# Altium schematic sheet Halfbridges.SchDoc
size 292 x 254 mm; CompanyName: Technische Hochschule Nürnberg Georg Simon Ohm; Organization: UltraZohm; Address1: Kesslerplatz 12; Address2: 90489 Nürnberg; Address3: GERMANY; SheetNumber: 5; SheetTotal: 8; Website: www.ultrazohm.com
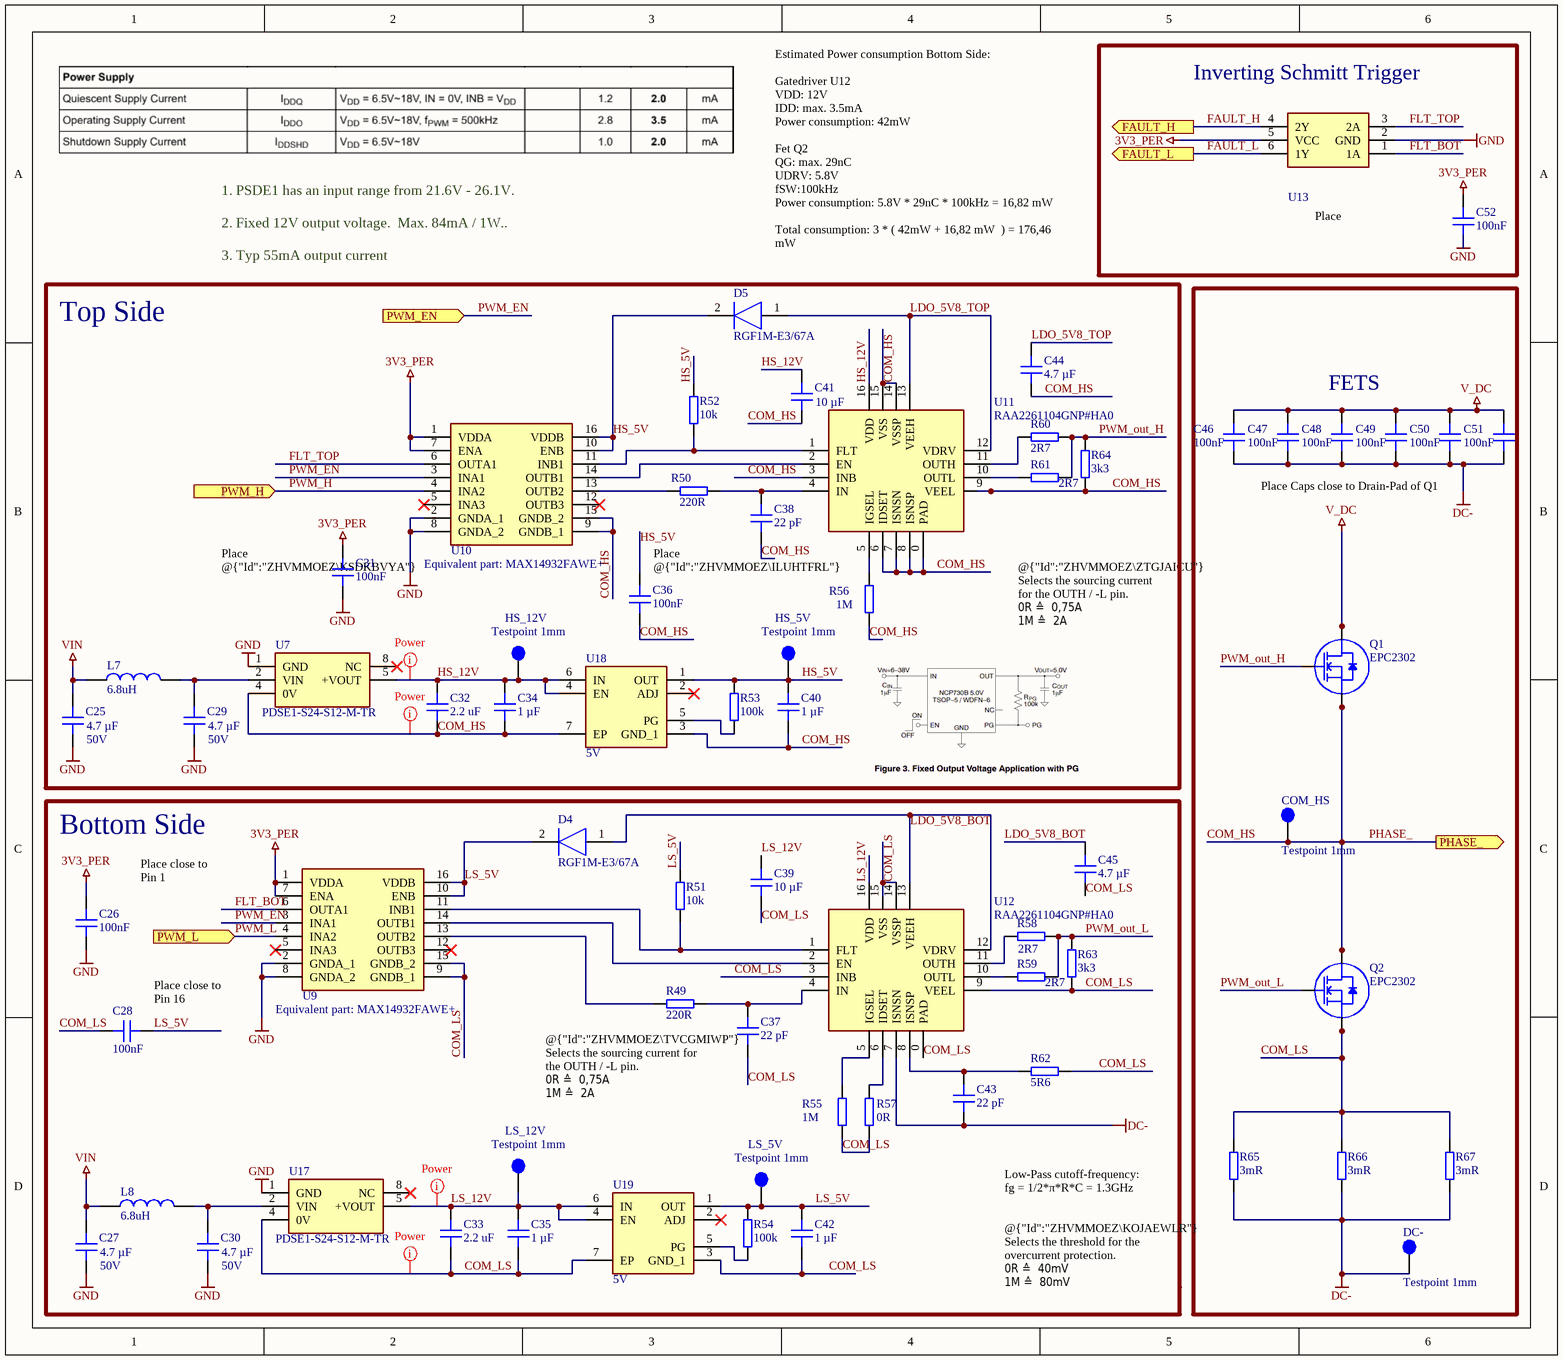
[diagram p0: Halfbridges.SchDoc]

## Parts
C25  4.7 µF  [C_0603]
C26  100nF  [C_0603]
C27  4.7 µF  [C_0603]
C28  100nF  [C_0603]
C29  4.7 µF  [C_0603]
C30  4.7 µF  [C_0603]
C31  100nF  [C_0603]
C32  2.2 uF  [C_0603]
C33  2.2 uF  [C_0603]
C34  1 µF  [C_0603]
C35  1 µF  [C_0603]
C36  100nF  [C_0603]
C37  22 pF  [C_0603]
C38  22 pF  [C_0603]
C39  10 µF  [C_0805]
C40  1 µF  [C_0603]
C41  10 µF  [C_0805]
C42  1 µF  [C_0603]
C43  22 pF  [C_0603]
C44  4.7 µF  [C_0603]
C45  4.7 µF  [C_0603]
C46  100nF  [C_0603]
C47  100nF  [C_0603]
C48  100nF  [C_0603]
C49  100nF  [C_0603]
C50  100nF  [C_0603]
C51  100nF  [C_0603]
C52  100nF  [C_0603]
COM_HS  Testpoint 1mm  [TP_1mm]  (no BOM)
D4  RGF1M-E3/67A  [FP-GF1M-E3-67A-MFG]
D5  RGF1M-E3/67A  [FP-GF1M-E3-67A-MFG]
DC-  Testpoint 1mm  [TP_1mm]  (no BOM)
HS_5V  Testpoint 1mm  [TP_1mm]  (no BOM)
HS_12V  Testpoint 1mm  [TP_1mm]  (no BOM)
L7  6.8uH  [INDC1608X95N]
L8  6.8uH  [INDC1608X95N]
LS_5V  Testpoint 1mm  [TP_1mm]  (no BOM)
LS_12V  Testpoint 1mm  [TP_1mm]  (no BOM)
Q1  EPC2302  [D0606F_100V]
Q2  EPC2302  [D0606F_100V]
R49  220R  [RES 0603_1608]
R50  220R  [RES 0603_1608]
R51  10k  [RES 0603_1608]
R52  10k  [RES 0603_1608]
R53  100k  [RES 0603_1608]
R54  100k  [RES 0603_1608]
R55  1M  [RES 1206_3216]
R56  1M  [RES 1206_3216]
R57  0R  [RES 0603_1608]
R58  2R7  [RES 0603_1608]
R59  2R7  [RES 0603_1608]
R60  2R7  [RES 0603_1608]
R61  2R7  [RES 0603_1608]
R62  5R6  [RES 0603_1608]
R63  3k3  [RES 0603_1608]
R64  3k3  [RES 0603_1608]
R65  3mR  [FP-KRL2012-MFG]
R66  3mR  [FP-KRL2012-MFG]
R67  3mR  [FP-KRL2012-MFG]
U7  PDSE1-S24-S12-M-TR  [PDSE1S24S12MTR]
U9  (no value)  [SOIC127P600X175-16N]
U10  (no value)  [SOIC127P600X175-16N]
U11  RAA2261104GNP#HA0  [RAA2261104GNP#HA0]
U12  RAA2261104GNP#HA0  [RAA2261104GNP#HA0]
U13  SN74LVC2G14DBVR  [SOT95P280X145-6N]  (value not drawn)
U17  PDSE1-S24-S12-M-TR  [PDSE1S24S12MTR]
U18  5V  [SON65P200X200X80-7N]
U19  5V  [SON65P200X200X80-7N]

## Blocks framed on the sheet
Inverting Schmitt Trigger: C52 U13
Top Side: C25 C29 C31 C32 C34 C36 C38 C40 C41 C44 D5 HS_5V HS_12V L7 R50 R52 R53 R56 R60 R61 R64 U7 U10 U11 U18
FETS: C46-C51 COM_HS DC- Q1 Q2 R65-R67

## Ports
FAULT_H (out), FAULT_L (out), PHASE_ (out), PWM_EN (in), PWM_H (in), PWM_L (in)

## Nets
3V3_PER: C26.2 C31.2 C52.2 U9.1(VDDA) U9.7(ENA) U10.1(VDDA) U10.7(ENA) U13.5(VCC)
DC-: C43.1 C46.1 C47.1 C48.1 C49.1 C50.1 C51.1 DC-.1 R65.1 R66.1 R67.1 U12.7(ISNSN)
GND: C25.2 C26.1 C27.2 C29.2 C30.2 C31.1 C52.1 U7.1(GND) U9.2(GNDA_1) U9.8(GNDA_2) U10.2(GNDA_1) U10.8(GNDA_2) U13.2(GND) U17.1(GND)
V_DC: C46.2 C47.2 C48.2 C49.2 C50.2 C51.2 Q1.3(D) Q1.5(D) Q1.7(D)
VIN: C25.1 C27.1 L7.1 L8.1
COM_HS: C32.1 C34.1 C36.1 C38.1 C40.1 C41.2 C44.2 COM_HS.1 Q1.2(S) Q1.4(S) Q1.6(S) Q2.3(D) Q2.5(D) Q2.7(D) R56.1 R64.1 U7.4(0V) U10.9(GNDB_1) U10.15(GNDB_2) U11.0(PAD) U11.3(INB) U11.6(IDSET) U11.7(ISNSN) U11.8(ISNSP) U11.9(VEEL) U11.14(VSSP) U11.15(VSS) U18.3(GND_1) U18.7(EP) ; port PHASE_  [also labelled PHASE_]
COM_LS: C28.2 C33.1 C35.1 C37.1 C39.2 C42.1 C45.1 Q2.2(S) Q2.4(S) Q2.6(S) R55.1 R57.1 R62.2 R63.1 R65.2 R66.2 R67.2 U9.9(GNDB_1) U9.15(GNDB_2) U12.0(PAD) U12.3(INB) U12.9(VEEL) U12.14(VSSP) U12.15(VSS) U17.4(0V) U19.3(GND_1) U19.7(EP)
FAULT_H: U13.4(2Y) ; port FAULT_H
FAULT_L: U13.6(1Y) ; port FAULT_L
FLT_BOT: U9.6(OUTA1) U13.1(1A)
FLT_TOP: U10.6(OUTA1) U13.3(2A)
HS_5V: C36.2 C40.2 D5.2(K) HS_5V.1 R52.2 R53.2 U10.10(ENB) U10.16(VDDB) U18.1(OUT)
HS_12V: C32.2 C34.2 C41.1 HS_12V.1 U7.5(+VOUT) U11.16(VDD) U18.4(EN) U18.6(IN)
LDO_5V8_BOT: C45.2 D4.1(A) U12.12(VDRV) U12.13(VEEH)
LDO_5V8_TOP: C44.1 D5.1(A) U11.12(VDRV) U11.13(VEEH)
LS_5V: C28.1 C42.2 D4.2(K) LS_5V.1 R51.2 R54.2 U9.10(ENB) U9.16(VDDB) U19.1(OUT)
LS_12V: C33.2 C35.2 C39.1 LS_12V.1 U12.16(VDD) U17.5(+VOUT) U19.4(EN) U19.6(IN)
PWM_EN: U9.3(INA1) U10.3(INA1) ; port PWM_EN
PWM_H: U10.4(INA2) ; port PWM_H
PWM_L: U9.4(INA2) ; port PWM_L
PWM_out_H: Q1.1(G) R60.2 R61.2 R64.2
PWM_out_L: Q2.1(G) R58.2 R59.2 R63.2
NetC29_1: C29.1 L7.2 U7.2(VIN)
NetC30_1: C30.1 L8.2 U17.2(VIN)
NetC37_2: C37.2 R49.2 U12.4(IN)
NetC38_2: C38.2 R50.2 U11.4(IN)
NetC43_2: C43.2 R62.1 U12.8(ISNSP)
NetR49_1: R49.1 U9.13(OUTB2)
NetR50_1: R50.1 U10.13(OUTB2)
NetR51_1: R51.1 U9.11(INB1) U12.1(FLT)
NetR52_1: R52.1 U10.11(INB1) U11.1(FLT)
NetR53_1: R53.1 U18.5(PG)
NetR54_1: R54.1 U19.5(PG)
NetR55_2: R55.2 U12.5(IGSEL)
NetR56_2: R56.2 U11.5(IGSEL)
NetR57_2: R57.2 U12.6(IDSET)
NetR58_1: R58.1 U12.11(OUTH)
NetR59_1: R59.1 U12.10(OUTL)
NetR60_1: R60.1 U11.11(OUTH)
NetR61_1: R61.1 U11.10(OUTL)
NetU9_14: U9.14(OUTB1) U12.2(EN)
NetU10_14: U10.14(OUTB1) U11.2(EN)

Not connected (* = marked no-connect by the designer): U7 8(NC)*; U9 5(INA3)* 12(OUTB3)*; U10 5(INA3)* 12(OUTB3)*; U17 8(NC)*; U18 2(ADJ)*; U19 2(ADJ)*

## Layout directives
net class Power: COM_HS, COM_LS, HS_12V, LS_12V

## Notes on the sheet
- (near C52) Place @{"Id":"ZHVMMOEZ\VVFJCAOA"} close to U13
- 1. PSDE1 has an input range from 21.6V - 26.1V.
  2. Fixed 12V output voltage.  Max. 84mA / 1W..
  3. Typ 55mA output current
- Estimated Power consumption Bottom Side:
  Gatedriver U12
  VDD: 12V
  IDD: max. 3.5mA
  Power consumption: 42mW
  Fet Q2
  QG: max. 29nC
  UDRV: 5.8V
  fSW:100kHz
  Power consumption: 5.8V * 29nC * 100kHz = 16,82 mW
  Total consumption: 3 * ( 42mW + 16,82 mW  ) = 176,46 mW
- Place Caps close to Drain-Pad of Q1
- (near C31) Place @{"Id":"ZHVMMOEZ\KSDKBVYA"} close to Pin 1
- Equivalent part: MAX14932FAWE+
- Place @{"Id":"ZHVMMOEZ\ILUHTFRL"} close to Pin 16
- @{"Id":"ZHVMMOEZ\ZTGJAICU"} Selects the sourcing current for the OUTH / -L pin.
  0R ≙  0,75A
  1M ≙  2A
- (near C25) 50V
- (near C29) 50V
- Bottom Side
- Place close to Pin 1
- (near C28) Place close to Pin 16
- (near U9) Equivalent part: MAX14932FAWE+
- @{"Id":"ZHVMMOEZ\TVCGMIWP"} Selects the sourcing current for the OUTH / -L pin.
  0R ≙  0,75A
  1M ≙  2A
- Low-Pass cutoff-frequency:
  fg = 1/2*π*R*C = 1.3GHz
- (near C27) 50V
- (near C30) 50V
- @{"Id":"ZHVMMOEZ\KOJAEWLR"} Selects the threshold for the overcurrent protection.
  0R ≙  40mV
  1M ≙  80mV
- Title
- Revision:
- Design Engineer:
- Date:
- Project:
- Sheet
- of

## Library data of the parts
C25 C27 C29 C30 C44 C45 = GRM188R6YA475KE15D: Capacitor 0603, 35 VDC, 4.7 µF, X5R; Manufacturer: muRata; Tolerance: 10 %; Voltage Rating: 35 VDC; Created from: MGremer; Manufacturer Part Number: GRM188R6YA475KE15D; PartID: 11; Created On: 12/20/2020 1:54:13 PM; ComponentLink1Description: Datasheet; ComponentLink1URL: https://www.mouser.de/datasheet/2/281/murata_03052018_GRM_Series_1-1310166.pdf; Component Type: Capacitor 0603; Device Package: 0603; Last Updated: 7/5/2023 3:51:21 PM; Mounting Type: SMD; Operating Temperature: -55 - 85°C; Series: GRM; Supplier 1: Mouser; Supplier Part Number 1: 81-GRM188R6YA475KE5D; Type: Capacitor; Value: 4.7 µF; Live Cycle Status: 1; Stock number: Labor SMD Container; LCSC Part Number: C162274
C26 C28 C31 C36 C46-C52 = CGA3E3X8R1H104KT0Y0N: 50V 100nF X8R ±10% 0603; Manufacturer: TDK; Voltage Rating: 50 VDC; Created from: KIlhan; Manufacturer Part Number: CGA3E3X8R1H104KT0Y0N; PartID: 131; Created On: 7/5/2023 7:32:58 PM; ComponentLink1Description: Datasheet; ComponentLink1URL: https://datasheet.lcsc.com/lcsc/2304140030_TDK-CGA3E3X8R1H104KT0Y0N_C342825.pdf; Component Type: Capacitor 0603; Device Package: 0603; Last Updated: 7/5/2023 7:32:58 PM; Mounting Type: SMD; Operating Temperature: -55 - 125°C; Series: CGA; Supplier 1: LCSC; Supplier Part Number 1: C342825; Type: Capacitor; Tolerance: 10 %; Value: 100nF; Live Cycle Status: 1; Stock number: not stored; LCSC Part Number: C342825
C32 C33 = FS18B225K250PBG: 25V 2.2uF X5R 0603 Multilayer Ceramic Capacitors MLCC; Manufacturer: PSA(Prosperity Dielectrics); Tolerance: 10 %; Voltage Rating: 25 VDC; Created from: KIlhan; Manufacturer Part Number: FS18B225K250PBG; PartID: 132; Created On: 7/5/2023 10:46:36 PM; ComponentLink1Description: Datasheet; ComponentLink1URL: https://jlcpcb.com/partdetail/3261675-FS18B225K250PBG/C2929194; Component Type: Capacitor 0603; Device Package: 0603; Last Updated: 7/5/2023 10:46:36 PM; Mounting Type: SMD; Operating Temperature: -55 - 125°C; Series: FS; Supplier 1: LCSC; Supplier Part Number 1: C2929194; Type: Capacitor; Value: 2.2 uF; Live Cycle Status: 1; LCSC Part Number: C2929194; Stock number: not stored
C34 C35 C40 C42 = UMK107AB7105KA-T: 50V 1uF X7R ±10% 0603 Multilayer Ceramic Capacitors MLCC - SMD/SMT ROHS; Manufacturer: Taiyo Yuden; Voltage Rating: 50 VDC; Created from: NDiringer; Manufacturer Part Number: UMK107AB7105KA-T; PartID: 98; Created On: 8/9/2022 9:35:02 AM; ComponentLink1Description: Datasheet; ComponentLink1URL: https://www.mouser.de/datasheet/2/396/mlcc02_e-1307760.pdf; Component Type: Capacitor 0603; Device Package: 0603; Last Updated: 9/21/2022 4:11:37 PM; Mounting Type: SMD; Operating Temperature: -55 - 125°C; Series: X7R; Supplier 1: LCSC; Supplier Part Number 1: C105174; Type: Capacitor; Tolerance: 10 %; Value: 1 µF; Live Cycle Status: 1; Stock number: not stored; LCSC Part Number: C105174; Supplier 2: Mouser; Supplier Part Number 2: 963-UMK107AB7105MA-T
C37 C38 C43 = AC0603FRNPO9BN220: 50V 22pF NP0 ±1% 0603 Multilayer Ceramic Capacitors MLCC - SMD/SMT ROHS; Manufacturer: YAGEO; Voltage Rating: 50 VDC; Created from: KIlhan; Manufacturer Part Number: AC0603FRNPO9BN220; PartID: 129; Created On: 7/5/2023 3:59:48 PM; ComponentLink1Description: Datasheet; ComponentLink1URL: https://www.mouser.de/datasheet/2/447/UPY_AC_NP0X7RX7S_6_3V_to_2KV_18-3003021.pdf; Component Type: Capacitor 0603; Device Package: 0603; Last Updated: 7/5/2023 6:57:50 PM; Mounting Type: SMD; Operating Temperature: -55 - 125°C; Series: AC; Supplier 1: Mouser; Supplier Part Number 1: 603-AC0603FRNP9BN220; Type: Capacitor; Tolerance: 1 %; Value: 22 pF; Live Cycle Status: 1; Stock number: not stored; LCSC Part Number: C2240294
C39 C41 = GRM219R61E106KA12D: Capacitor 0805, 25 VDC, 10 µF, X5R; Manufacturer: muRata; Tolerance: 10 %; Voltage Rating: 25 VDC; Created from: MGremer; Manufacturer Part Number: GRM219R61E106KA12D; PartID: 13; Created On: 12/20/2020 1:54:13 PM; ComponentLink1Description: Datasheet; ComponentLink1URL: https://www.mouser.de/datasheet/2/281/murata_03052018_GRM_Series_1-1310166.pdf; Component Type: Capacitor 0805; Device Package: 0805; Last Updated: 5/27/2022 2:14:39 PM; Mounting Type: SMD; Operating Temperature: -55 - 85°C; Series: GRM; Supplier 1: Mouser; Supplier Part Number 1: 81-GRM219R61E106KA2D; Type: Capacitor; Value: 10 µF; Live Cycle Status: 1; Stock number: Labor SMD Container; LCSC Part Number: C15850
COM_HS DC- HS_5V HS_12V LS_5V LS_12V = NULL: Manufacturer Part Number: NULL; Created from: AGeiger; Created: 2018_06_25_AGeiger; Value: Testpoint 1mm; PartID: 9; Created On: 9/20/2022 1:14:57 PM; Component Type: Testpoint; Last Updated: 9/20/2022 1:15:39 PM; Manufacturer: NULL; Supplier 1: NULL; Supplier Part Number 1: NULL; Type: Testpoint; Live Cycle Status: 1
D4 D5 = RGF1M-E3/67A: Diodes - General Purpose, Power, Switching 1 Amp 1000Volt 500ns 30 Amp IFSM; Manufacturer: Vishay; Type: Rectifier; Created from: KIlhan; Category: standard; Created: 2020_10_28_MGremer; Manufacturer Part Number: RGF1M-E3/67A; Supplier 1: Mouser; Supplier Part Number 1: 625-GF1M-E3; PartID: 3; Created On: 6/14/2023 4:03:51 PM; ComponentLink1Description: Datasheet; ComponentLink1URL: https://datasheet.lcsc.com/lcsc/2208161803_Vishay-Intertech-GF1M-E3-67A_C968643.pdf; Component Type: Rectifier diode; Last Updated: 6/16/2023 1:53:22 PM; Mounting Type: SMD/SMT; Operating Temperature: -65 to 175 °C; Live Cycle Status: 1; LCSC Part Number: C3008881; Stock number: not stored
L7 L8 = CMCW1608F6R8KTT: 6.8uH ±10% 0603 Inductors (SMD) ROHS; Manufacturer: Cybermax; MF: EPCOS / TDK; DCR: 320m; Rated Current: 0.85 A; Type: fixed inductor; DC current: 15mA; Created from: KIlhan; MPN: B82464G4154M; Supplier 1: LCSC; Supplier Part Number 1: C961362; Value: 6.8uH; Manufacturer Part Number: CMCW1608F6R8KTT; PartID: 17; Created On: 7/5/2023 8:42:04 PM; ComponentLink1Description: Datasheet; ComponentLink1URL: https://jlcpcb.com/partdetail/Cybermax-CMCW1608F6R8KTT/C961362; Component Type: SMD fixed inductor; Device Package: SMD; Last Updated: 7/5/2023 8:42:04 PM; Mounting Type: SMD; Operating Temperature: -40 - 85 °C; Live Cycle Status: 1; LCSC Part Number: C961362; Stock number: C961362
Q1 Q2 = EPC2302: N-Channel 100 V 101A (Ta) Surface Mount 7-QFN (3x5); Manufacturer: EPC; Type: GaN FET; Value: 100V, 101A; Created from: KIlhan; Manufacturer Part Number: EPC2302; PartID: 6; Created On: 6/14/2023 12:51:57 PM; ComponentLink1Description: Datasheet; ComponentLink1URL: https://epc-co.com/epc/Portals/0/epc/documents/datasheets/EPC2302_datasheet.pdf; Component Type: GaN Transistor; Device Package: 7-QFN; Last Updated: 6/15/2023 8:08:35 PM; Mounting Type: SMD; Operating Temperature: -55 to +150 °C; Series: eGaN; Supplier 1: LCSC; Supplier Part Number 1: C5353503; Supplier 2: EPC; Live Cycle Status: 1; LCSC Part Number: C5353503; Stock number: not stored
R49 R50 = MR06X221JTL: 125mW ±100ppm/℃ ±5% 220Ω 0603 Chip Resistor - Surface Mount ROHS; Manufacturer: Walsin Tech Corp; Created from: KIlhan; Manufacturer Part Number: MR06X221JTL; PartID: 283; Created On: 7/5/2023 6:42:21 PM; ComponentLink1Description: Datasheet; ComponentLink1URL: https://jlcpcb.com/partdetail/Walsin_TechCorp-MR06X221JTL/C327834; Component Type: SMD resistor; Device Package: 0603; Last Updated: 7/5/2023 6:42:21 PM; Mounting Type: SMD; Supplier 1: LCSC; Supplier Part Number 1: C327834; Type: Resistor; Tolerance: 5%; Value: 220R; Live Cycle Status: 1; Stock number: not stored; LCSC Part Number: C327834
R51 R52 = RK73B1JTTD103J: SMD resistor E24 series; Manufacturer: KOA Speer; Tolerance: 5%; Created from: MGremer; Manufacturer Part Number: RK73B1JTTD103J; PartID: 98; Created On: 12/14/2020 4:17:14 PM; ComponentLink1Description: Datasheet; ComponentLink1URL: https://www.mouser.de/datasheet/2/219/RK73B-1825463.pdf; Component Type: SMD resistor; Device Package: 0603; Last Updated: 5/27/2022 2:04:22 PM; Mounting Type: SMD; Supplier 1: Mouser; Supplier Part Number 1: 660-RK73B1JTTD103J; Type: Resistor; Value: 10k; Live Cycle Status: 1; Stock number: Labor SMD Container; LCSC Part Number: C25804
R53 R54 = RMCF0603FT100K: 100mW Thick Film Resistors ±100ppm/℃ ±1% 100kΩ 0603 Chip Resistor - Surface Mount ROHS; Manufacturer: SEI(Stackpole Elec); Created from: KIlhan; Manufacturer Part Number: RMCF0603FT100K; PartID: 284; Created On: 7/5/2023 6:45:39 PM; ComponentLink1Description: Datasheet; ComponentLink1URL: https://jlcpcb.com/partdetail/sei_stackpole_elec-RMCF0603FT100K/C237792; Component Type: SMD resistor; Device Package: 0603; Last Updated: 7/5/2023 6:45:39 PM; Mounting Type: SMD; Supplier 1: LCSC; Supplier Part Number 1: C237792; Type: Resistor; Tolerance: 1%; Value: 100k; Live Cycle Status: 1; Stock number: not stored; LCSC Part Number: C237792
R55 R56 = KTR18EZPF1004: SMD resistor 0.1%; Manufacturer: ROHM; Tolerance: 1 %; Created from: MGremer; Manufacturer Part Number: KTR18EZPF1004; PartID: 175; Created On: 12/14/2020 4:17:14 PM; ComponentLink1Description: Datasheet; ComponentLink1URL: http://www.farnell.com/datasheets/3171135.pdf; Component Type: SMD resistor; Device Package: 1206; Last Updated: 7/5/2023 6:47:13 PM; Mounting Type: SMD; Supplier 1: Farnell; Supplier Part Number 1: 2802466; Type: Resistor; Value: 1M; Live Cycle Status: 1; Stock number: not stored; LCSC Part Number: C253347
R57 = RC0603JR-070RL: SMD resistor E24 series; Manufacturer: YAGEO; Tolerance: 5%; Created from: MGremer; Manufacturer Part Number: RC0603JR-070RL; PartID: 1; Created On: 12/14/2020 4:17:14 PM; ComponentLink1Description: Datasheet; ComponentLink1URL: https://www.mouser.de/datasheet/2/447/PYu-RC_Group_51_RoHS_L_10-1664068.pdf; Component Type: SMD resistor; Device Package: 0603; Last Updated: 3/4/2021 9:09:42 AM; Mounting Type: SMD; Supplier 1: Mouser; Supplier Part Number 1: 603-RC0603JR-070RL; Type: Resistor; Value: 0R; Live Cycle Status: 1; Stock number: Labor SMD Container; LCSC Part Number: C21189; Supplier 2: LCSC; Supplier Part Number 2: C21189
R58-R61 = HPCR0603F2R70S9: 200mW Thick Film Resistors ±1% ±250ppm/℃ 2.7Ω 0603 Chip Resistor - Surface Mount ROHS; Manufacturer: Resistor.Today; Created from: KIlhan; Manufacturer Part Number: HPCR0603F2R70S9; PartID: 273; Created On: 6/14/2023 2:23:20 PM; ComponentLink1Description: Datasheet; ComponentLink1URL: https://datasheet.lcsc.com/lcsc/2108150030_Resistor-Today-HPCR0603F2R70S9_C2849050.pdf; Component Type: SMD resistor; Device Package: 0603; Last Updated: 6/14/2023 2:35:17 PM; Mounting Type: SMD; Supplier 1: LCSC; Supplier Part Number 1: C2849050; Type: Resistor; Tolerance: 1%; Value: 2R7; Live Cycle Status: 1; Stock number: not stored; LCSC Part Number: C2849050
R62 = HPCR0603F5R60S9: 200mW Thick Film Resistors ±1% ±250ppm/℃ 5.6Ω 0603 Chip Resistor - Surface Mount ROHS; Manufacturer: Resistor.Today; Created from: KIlhan; Manufacturer Part Number: HPCR0603F5R60S9; PartID: 274; Created On: 6/14/2023 2:35:17 PM; ComponentLink1Description: Datasheet; ComponentLink1URL: https://datasheet.lcsc.com/lcsc/2108142330_Resistor-Today-HPCR0603F5R60S9_C2849053.pdf; Component Type: SMD resistor; Device Package: 0603; Last Updated: 6/14/2023 2:35:17 PM; Mounting Type: SMD; Supplier 1: LCSC; Supplier Part Number 1: C2849053; Type: Resistor; Tolerance: 1%; Value: 5R6; Live Cycle Status: 1; Stock number: not stored; LCSC Part Number: C2849053
R63 R64 = 0603WAF3301T5E: 100mW Thick Film Resistors 75V ±100ppm/℃ ±1% -55℃~+155℃ 3.3kΩ 0603  Chip Resistor - Surface Mount ROHS; Manufacturer: UNI-ROYAL; Created from: AGeiger; Manufacturer Part Number: 0603WAF3301T5E; PartID: 245; Created On: 9/21/2022 4:03:17 PM; ComponentLink1Description: Datasheet; ComponentLink1URL: https://datasheet.lcsc.com/lcsc/2206010116_UNI-ROYAL-Uniroyal-Elec-0603WAF3301T5E_C22978.pdf; Component Type: SMD resistor; Device Package: 0603; Last Updated: 9/21/2022 4:03:17 PM; Mounting Type: SMD; Supplier 1: LCSC; Supplier Part Number 1: C22978; Type: Resistor; Tolerance: 1%; Value: 3k3; Live Cycle Status: 1; LCSC Part Number: C22978
R65-R67 = KRL2012E-M-R003-F-T5: 1W ±50ppm/℃ ±1% 3mΩ 2012 Chip Resistor - Surface Mount ROHS; Manufacturer: SUSUMU; Created from: KIlhan; Manufacturer Part Number: KRL2012E-M-R003-F-T5; PartID: 275; Created On: 6/14/2023 2:50:59 PM; ComponentLink1Description: Datasheet; ComponentLink1URL: https://www.susumu.co.jp/common/pdf/n_catalog_partition19_en.pdf; Component Type: SMD resistor; Device Package: 2012; Last Updated: 6/16/2023 12:10:45 PM; Mounting Type: SMD; Supplier 1: LCSC; Supplier Part Number 1: C4057585; Type: Resistor; Tolerance: 1%; Value: 3mR; Live Cycle Status: 1; Stock number: not stored; LCSC Part Number: C4057585
U7 U17 = PDSE1-S24-S12-M-TR: Isolated, 21.6 -26.4Vin, 12V out, 1W, 84mA out; Manufacturer: CUI Inc.; Created from: DHufnagel; Manufacturer Part Number: PDSE1-S24-S12-M-TR; PartID: 21; Created On: 7/19/2022 2:22:00 PM; ComponentLink1Description: Datasheet; ComponentLink1URL: https://www.mouser.de/datasheet/2/670/pdse1_m-1596038.pdf; Component Type: Isolated DC-DC Converter; Device Package: SMT-5; Last Updated: 7/5/2023 5:07:31 PM; Mounting Type: SMT; Operating Temperature: -40 - 105°C; Series: PDSE1-M; Supplier 1: Mouser; Supplier Part Number 1: 490-PDSE1-S24-S12MTR; Supplier 2: Digi-Key; Supplier Part Number 2: 102-PDSE1-S24-S12-M-TRCT-ND; Type: isolated DC-DC Converter; Value: 1 W; Live Cycle Status: 1; Stock number: not stored; LCSC Part Number: C6730719
U9 U10 = MAX14931FASE+: Digital Isolators 4 channel (3/1 config), 150Mbps, 2.5kVrms digital isolator, default low,NSOIC-16, -40C to +125C; Manufacturer: Maxim Integrated; Channels: 4; Created from: KIlhan; Manufacturer Part Number: MAX14931FASE+; PartID: 5; Created On: 6/14/2023 11:53:18 PM; ComponentLink1Description: Datasheet; ComponentLink1URL: https://www.mouser.de/datasheet/2/609/MAX14130_MAX14932-3127087.pdf; Component Type: Digital Isolator; Last Updated: 7/11/2023 4:37:47 PM; Mounting Type: SMD; Operating Temperature: -40 - +125 °C; Supplier 1: Mouser; Supplier Part Number 1: 700-MAX14931FASE+; Type: Digital Isolator; Live Cycle Status: 1; LCSC Part Number: C402923
U11 U12 = RAA2261104GNP#HA0: Low Side MOSFET 2A 6.5V~18V 1.2A QFN-16(4x4) Gate Drive ICs ROHS; Manufacturer: Renesas; Created from: KIlhan; Manufacturer Part Number: RAA2261104GNP#HA0; PartID: 3; Created On: 6/14/2023 5:51:39 PM; ComponentLink1Description: Datasheet; ComponentLink1URL: https://www.mouser.de/datasheet/2/698/REN_RAA226110_DST_20200915-2930947.pdf; Component Type: Gate Driver; Device Package: QFN-16(4x4); Last Updated: 6/14/2023 5:51:39 PM; Mounting Type: SMD; Operating Temperature: -40 - 125 °C; Supplier 1: Mouser; Supplier Part Number 1: 968-2261104GNP#HA0; Type: Gate Driver; Live Cycle Status: 1; LCSC Part Number: C3654979; Stock number: not stored
U13 = SN74LVC2G14DBVR: Dual Schmitt Trigger Inverter; Manufacturer: Texas Instruments; Created from: MGremer; Manufacturer Part Number: SN74LVC2G14DBVR; PartID: 12; Created On: 11/8/2021 12:38:27 PM; ComponentLink1Description: Datasheet; ComponentLink1URL: https://www.ti.com/lit/ds/symlink/sn74lvc2g14.pdf; Component Type: Inverter; Device Package: SOT-23-6; Last Updated: 6/15/2023 4:38:43 PM; Mounting Type: SMD; Operating Temperature: -40 - 125 °C; Series: SN74LVC2G14; Supplier 1: Mouser; Supplier Part Number 1: 595-SN74LVC2G14DBVR; Type: Inverter; Live Cycle Status: 1; LCSC Part Number: C12401
U18 U19 = NCP730BMT500TBG: LDO Voltage Regulators 150mA 38V 1uA IQ; Manufacturer: onsemi; Created from: KIlhan; Manufacturer Part Number: NCP730BMT500TBG; PartID: 14; Created On: 6/15/2023 5:08:23 PM; ComponentLink1Description: Datasheet; ComponentLink1URL: https://eu.mouser.com/datasheet/2/308/1/NCP730_D-2317345.pdf; Component Type: LDO; Device Package: SMD; Last Updated: 6/15/2023 5:08:23 PM; Mounting Type: SMD; Operating Temperature: -40 - 150 °C; Series: NCP730; Supplier 1: Mouser; Supplier Part Number 1: 863-NCP730BMT500TBG; Type: LDO; Value: 5V; Live Cycle Status: 1; LCSC Part Number: C892822; Stock number: not stored